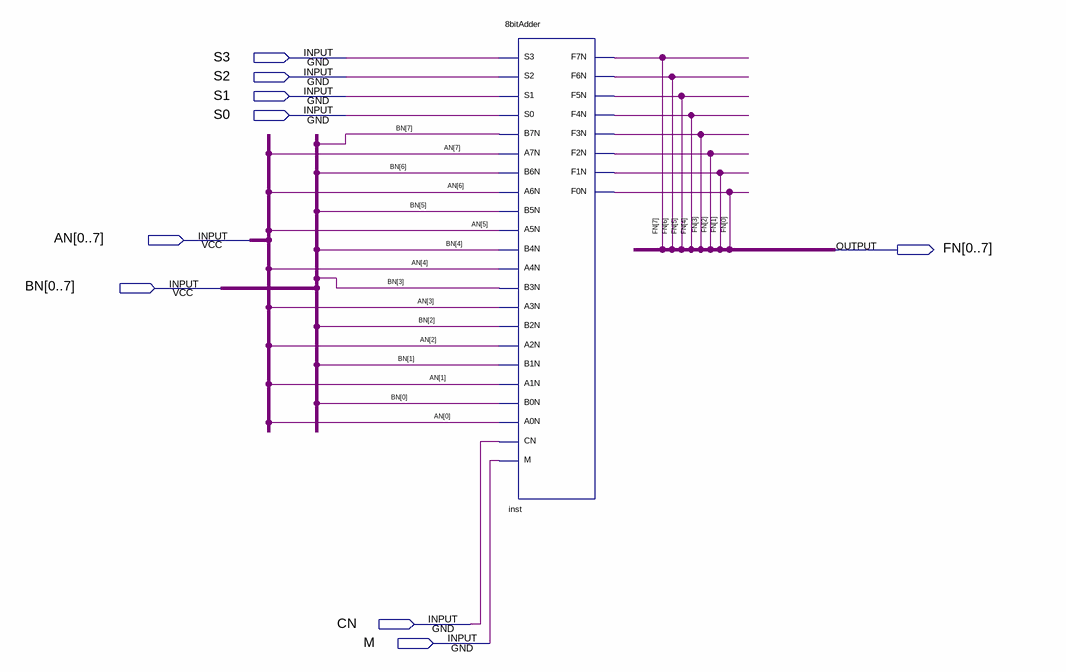
[diagram p0: schematic sheet]
// Quartus schematic 8bitAdderBus.bdf as structural Verilog: 1 symbols, 9 pins
module \8bitAdderBus  (
  input  S3,
  input  S2,
  input  S1,
  input  S0,
  input  [0:7] AN,
  input  [0:7] BN,
  input  CN,
  input  M,
  output [0:7] FN
);

  \8bitAdder  inst (
    .S3(S3), .S2(S2), .S1(S1), .S0(S0), .B7N(BN[7]), .A7N(AN[7]), .B6N(BN[6]), .A6N(AN[6]), .B5N(BN[5]),
    .A5N(AN[5]), .B4N(BN[4]), .A4N(AN[4]), .B3N(BN[3]), .A3N(AN[3]), .B2N(BN[2]), .A2N(AN[2]), .B1N(BN[1]),
    .A1N(AN[1]), .B0N(BN[0]), .A0N(AN[0]), .CN(CN), .M(M), .F7N(FN[7]), .F6N(FN[6]), .F5N(FN[5]),
    .F4N(FN[4]), .F3N(FN[3]), .F2N(FN[2]), .F1N(FN[1]), .F0N(FN[0]));
endmodule
